# EasyEDA Pro project main.eprj

# Schematic Schematic

## Sheets
1 ESP32-S3-Mini-1U-N4R2: Board Name: Board1; Create Date: 2026-08-17; Page Name: P1; Project Name: ESP32-S3; Schematic Name: Schematic1; Update Date: 2026-08-17; Company: EasyEDA.com; Page Size: A4; Version: V1.0
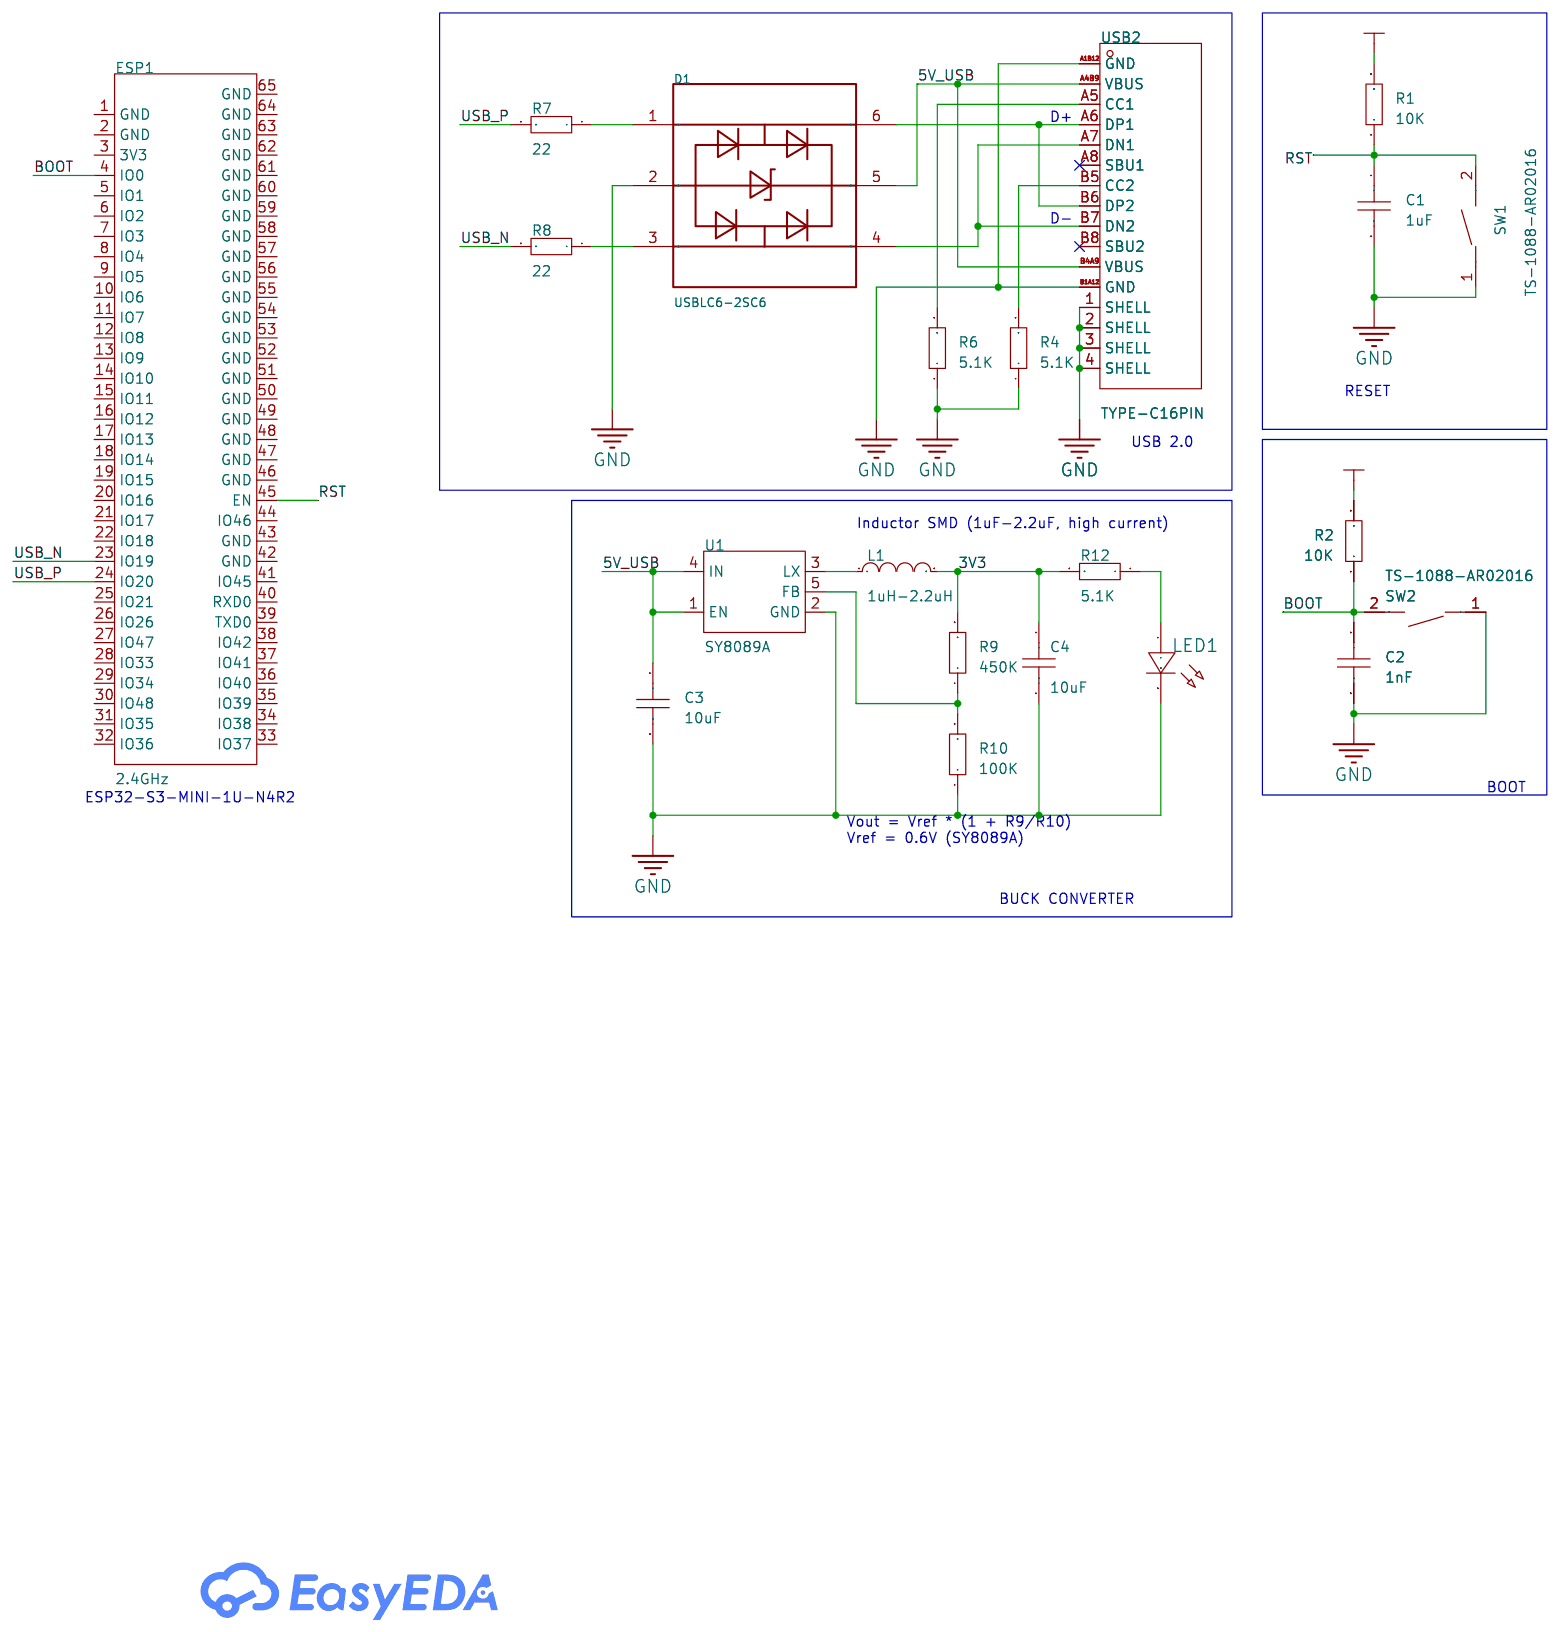
[diagram p0: ESP32-S3-Mini-1U-N4R2]
2 SIM7670G: Create Date: 2026-08-18; Page Name: SIM7670G; Schematic Name: Schematic; Update Date: 2026-08-18
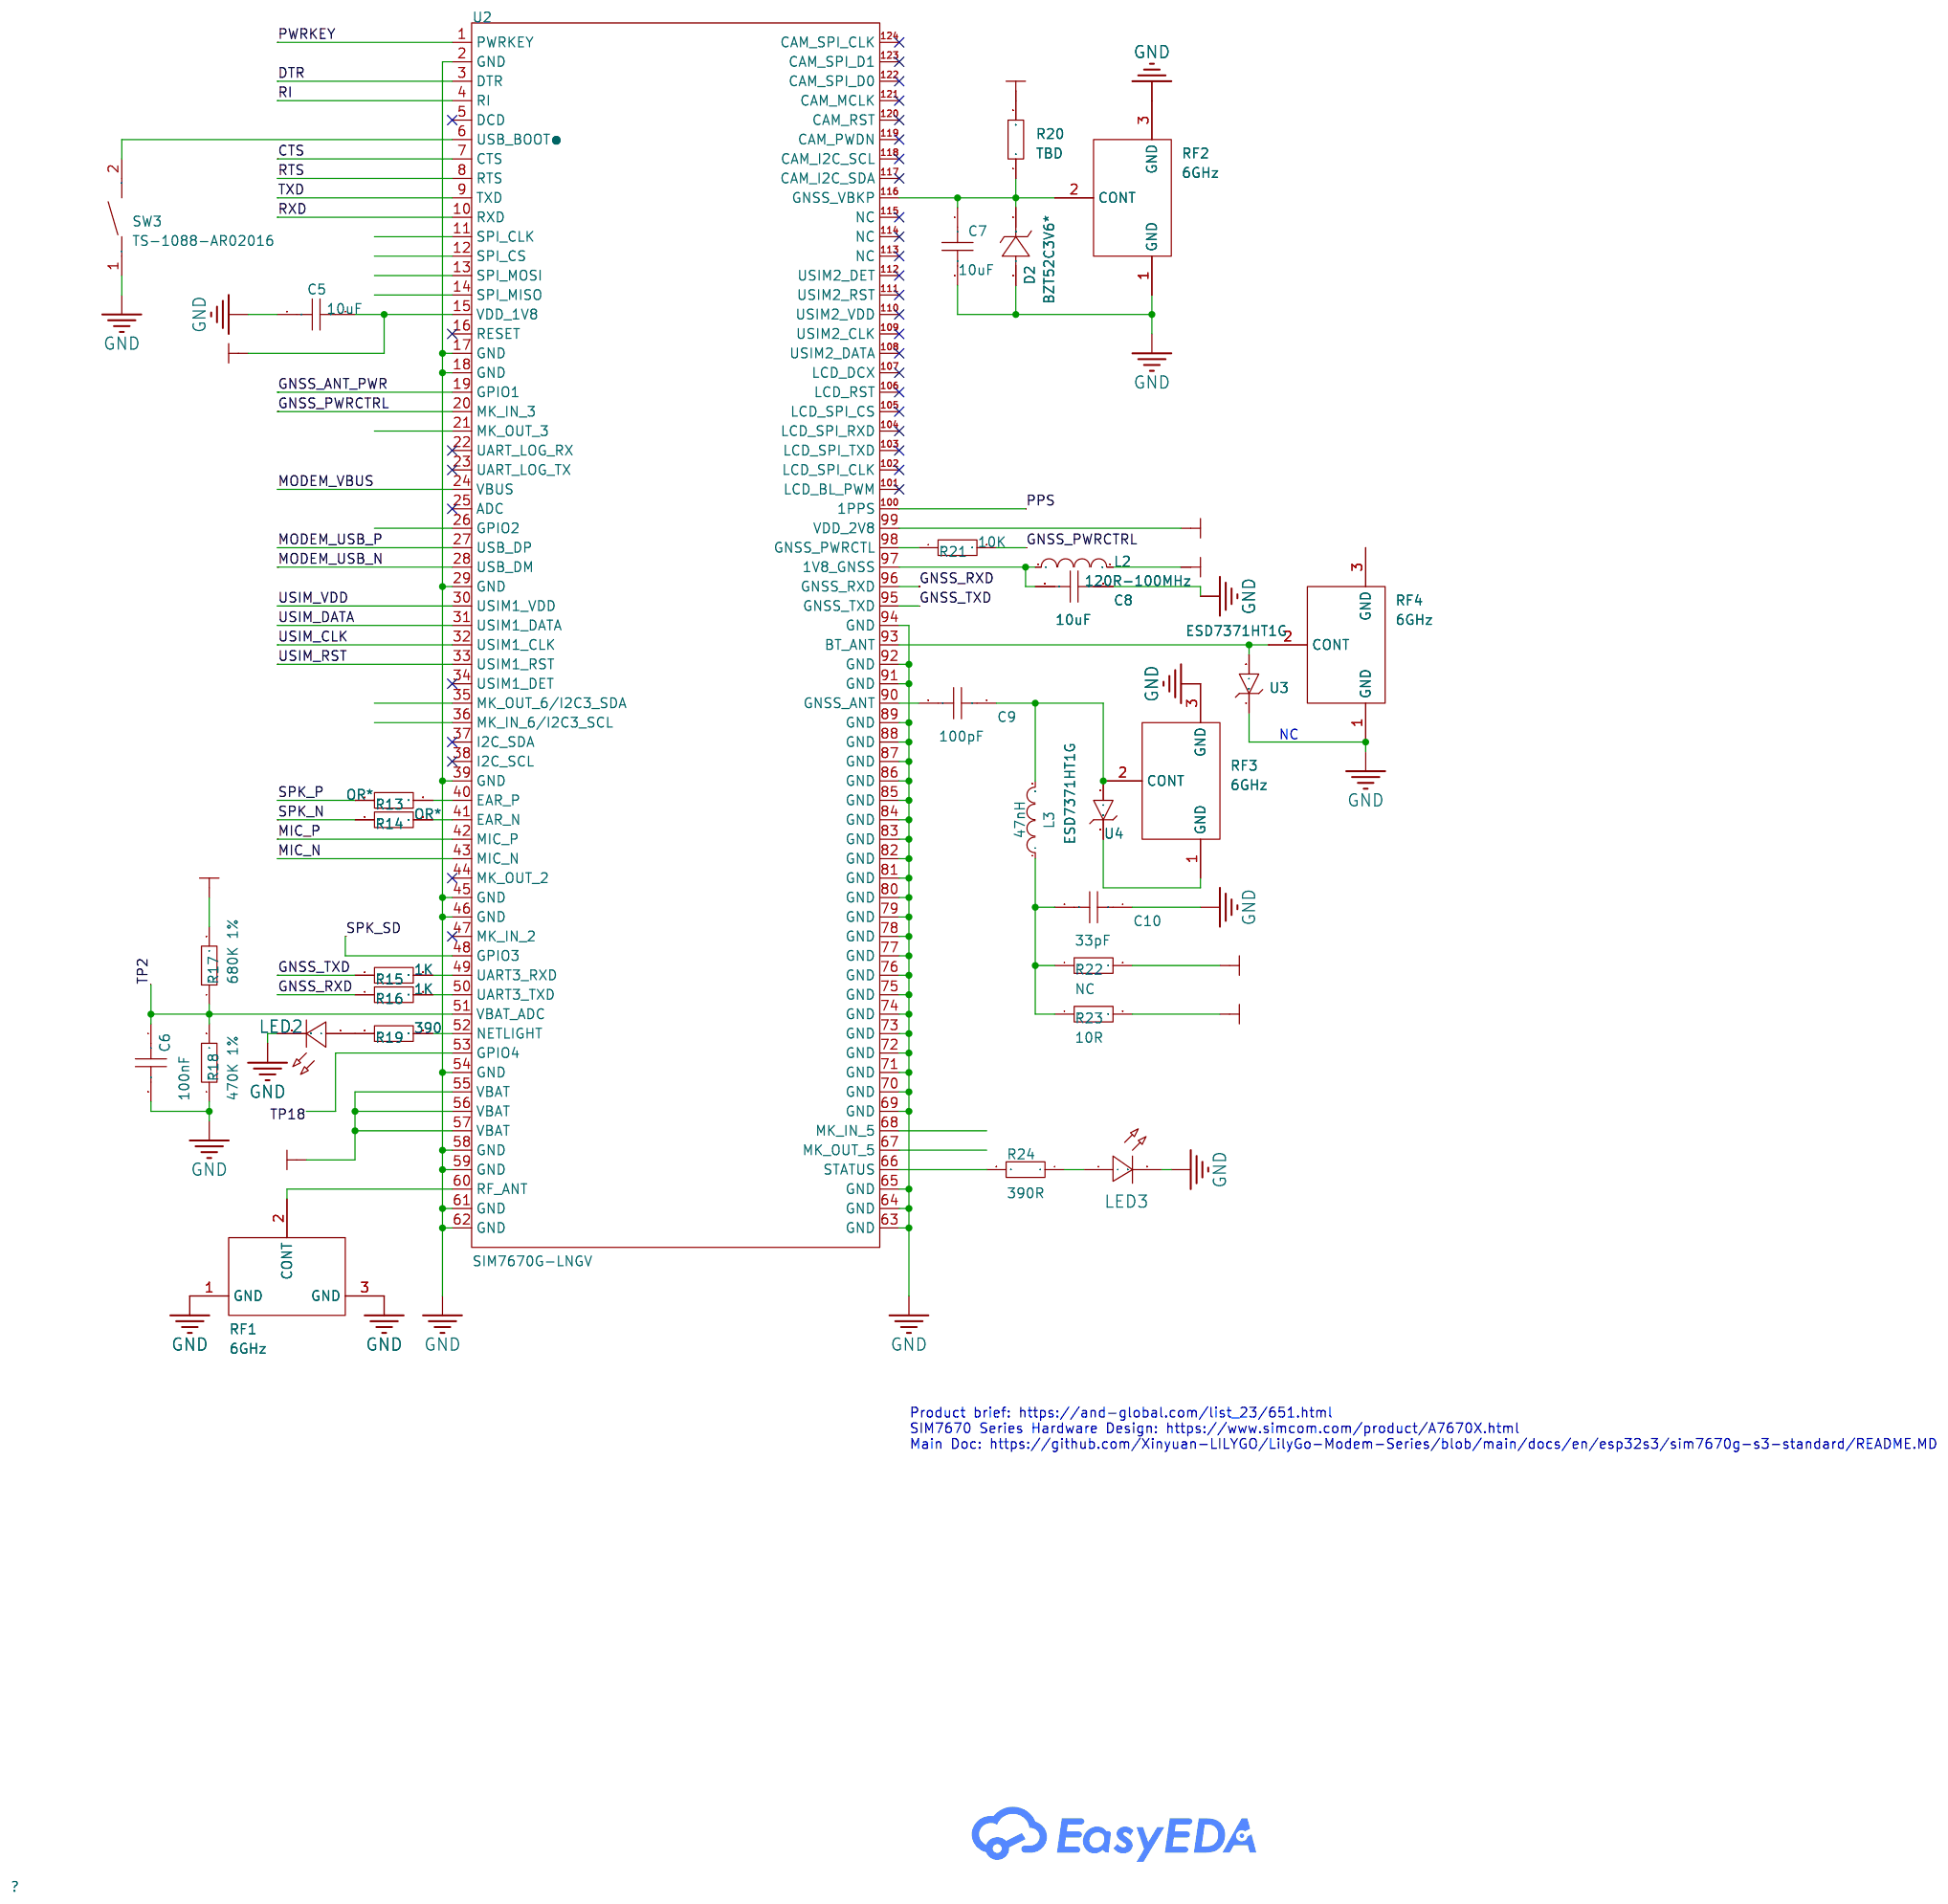
[diagram p1: SIM7670G]
3 SIM7670C: Create Date: 2026-08-18; Project Name: Project Name; Schematic Name: Schematic Name; Update Date: 2021.11.05
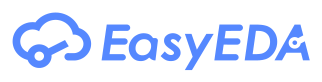
[diagram p2: SIM7670C]

## Parts
sheet ESP32-S3-Mini-1U-N4R2
C1  1uF  [C0603]
C2  1nF  [C0603]
C3  10uF  [C0603]
C4  10uF  [C0603]
D1  USBLC6-2SC6  [TSOT-23-6_L2.9-W1.6-P0.95-LS2.8-BR]
ESP1  2.4GHz  [BULETM-SMD_ESPRESSIF_ESP32-S3-MINI-1U-N8]
L1  1uH-2.2uH  [L0603]
LED1  -  [LED0402-RD_YELLOW]
R1  10K  [R0603]
R2  10K  [R0603]
R4  5.1K  [R0603]
R6  5.1K  [R0603]
R7  22  [R0603]
R8  22  [R0603]
R9  450K  [R0603]
R10  100K  [R0603]
R12  5.1K  [R0603]
SW1  TS-1088-AR02016  [SW-SMD_L3.9-W3.0-P4.45]
SW2  TS-1088-AR02016  [SW-SMD_L3.9-W3.0-P4.45]
U1  SY8089A  [SOT-23-5_L3.0-W1.7-P0.95-LS2.8-BL]
USB2  TYPE-C16PIN  [USB-C-SMD_TYPE-C16PIN]
sheet SIM7670G
C5  10uF  [C0603]
C6  100nF  [C0603]
C7  10uF  [C0603]
C8  10uF  [C0603]
C9  100pF  [C0603]
C10  33pF  [C0603]
D2  BZT52C3V6*  [SOD-123_L2.8-W1.8-LS3.7-RD]
L2  120R-100MHz  [L0603]
L3  47nH  [L0603]
LED2  -  [LED0402-RD_YELLOW]
LED3  -  [LED0402-RD_YELLOW]
R13  OR*  [R0603]
R14  OR*  [R0603]
R15  1K  [R0603]
R16  1K  [R0603]
R17  680K 1%  [R0603]
R18  470K 1%  [R0603]
R19  390  [R0603]
R20  TBD  [R0603]
R21  10K  [R0603]
R22  NC  [R0603]
R23  10R  [R0603]
R24  390R  [R0603]
RF1  6GHz  [ANT-SMD_UFL-R-SMT01]
RF2  6GHz  [ANT-SMD_UFL-R-SMT01]
RF3  6GHz  [ANT-SMD_UFL-R-SMT01]
RF4  6GHz  [ANT-SMD_UFL-R-SMT01]
SW3  TS-1088-AR02016  [SW-SMD_L3.9-W3.0-P4.45]
U2  SIM7670G-LNGV  [LCC-124_L24.0-W24.0-P1.0-TL]
U3  ESD7371HT1G  [SOD-323_L1.7-W1.3-LS2.5-RD]
U4  ESD7371HT1G  [SOD-323_L1.7-W1.3-LS2.5-RD]

## Library data of the parts
C1-C10 = CAP_0603: Supplier Footprint: 0603
D1 = USBLC6-2SC6_C48971164: LCSC Part Name: ESD 5V截止 峰值浪涌电流：6A@8/20us; Supplier Part: C48971164; Manufacturer: Slkor(萨科微); Supplier Footprint: SOT-23-6L; JLCPCB Part Class: Extended Part; Datasheet: https://item.szlcsc.com/datasheet/USBLC6-2SC6/51296793.html; Supplier: LCSC; Reverse Stand-Off Voltage (Vrwm): 5V; Clamping Voltage: 13V; Peak Pulse Current (Ipp): 6A@8/20us; Peak Pulse Power Dissipation (Ppp): 78W@8/20us; Voltage - Breakdown: 9V; Reverse Leakage Current (Ir): 100nA; Number of Channels: 2; Operating Temperature: -40℃~+125℃; level of protection: IEC 61000-4-2; Type: ESD; Junction Capacitance: 0.5pF；1pF
ESP1 = ESP32-S3-MINI-1U-N4R2: LCSC Part Name: 不带固件 小尺寸模组，集成2.4GHz Wi-Fi(802.11b/g/n)+Bluetooth 5(LE); Supplier Part: C22356044; Manufacturer: ESPRESSIF(乐鑫); Supplier Footprint: SMD,15.4x15.4mm; JLCPCB Part Class: Extended Part; Datasheet: https://item.szlcsc.com/datasheet/ESP32-S3-MINI-1U-N4R2/23788626.html; Supplier: LCSC; Utilized IC / Part: ESP32-S3FH4R2; Interface Type: I2C；UART；SPI；USB；I2S; Output Power: 20.5dBm; Voltage - Supply: 3V~3.6V; Receive  Current: 95mA; Send  Current: 355mA; Sensitivity: -98.2dBm; Operating Temperature: -40℃~+85℃
L1-L3 = L_0603
LED1-LED3 = LED_0402-R: Supplier Footprint: 0402
R1 R2 R4 R6-R10 R12-R24 = Res_0603: Supplier Footprint: 0603
SW1-SW3 = TS-1088-AR02016: LCSC Part Name: 3.9*3*2mm 立贴 轻触开关; Supplier Part: C720477; Manufacturer: XUNPU(讯普); Supplier Footprint: SMD,4x3mm; JLCPCB Part Class: Basic Part; Datasheet: https://item.szlcsc.com/datasheet/TS-1088-AR02016/763484.html; Supplier: LCSC; Circuit: SPST; Actuator Style: Round Button; Operating Force: 1.6N; Mounting Type: Surface Mount,Vertical; Length: 3.9mm; Width: 3mm; Switch Height: 2mm; with Bracket: Without Bracket; Contact Current: 50mA; Voltage Rating: 12V; Actuator/Cap Color: Black; Termination Style: SMD(SMT) Tab; Life: 100,000 cycles; Operating Temperature: -30℃~+80℃
U1 = SY8089A: LCSC Part Name: 降压型 2A 2.5V~5.5V; Supplier Part: C41348273; Manufacturer: TECH PUBLIC(台舟); Supplier Footprint: SOT-23-5; JLCPCB Part Class: Extended Part; Datasheet: https://item.szlcsc.com/datasheet/SY8089A/43078192.html; Supplier: LCSC; Function: Step-down type; Voltage - Supply: 2.5V~5.5V; Output Current: 2A; Frequency - Switching: 1MHz; Operating Temperature: -40℃~+125℃@(TJ); Synchronous Rectifier: No; Number of Outputs: 1; Topology: Buck; Quiescent Current: 50uA; Switch tube (built-in/external): Built-in; Output Type: Adjustable; Features: Cycle-by-cycle current limiting；Overcurrent Protection
USB2 = TYPE-C16PIN: LCSC Part Name: 16P卧贴母座; Supplier Part: C393939; Manufacturer: SHOU HAN(首韩); Supplier Footprint: SMD; JLCPCB Part Class: Extended Part; Datasheet: https://item.szlcsc.com/datasheet/TYPE-C16PIN/372551.html; Supplier: LCSC; Connector Type: Type-C; Gender: Female; Mounting Type: Surface Mount, Right Angle; Number of Contacts: 16P; Number of Ports: 1; Current Rating-Power: 3A; Voltage Rating: 30V; Connect-Disconnect Life: 10,000 Cycles; Detection color: Black; Operating Temperature: -40℃~+85℃
D2 = BZT52C3V6_C49652771: LCSC Part Name: 3.6V 5uA@1.0V; Supplier Part: C49652771; Manufacturer: PAKER(派克微); Supplier Footprint: SOD-123; JLCPCB Part Class: Extended Part; Datasheet: https://item.szlcsc.com/datasheet/BZT52C3V6/52209955.html; Supplier: LCSC; Diode Configuration: 1 Independent; Zener Voltage(Nom): 3.6V; Reverse Leakage Current (Ir): 5uA@1V; Zener Voltage(Range): 3.4V~3.8V; Pd - Power Dissipation: 350mW; Impedance(Zzt): 90Ω; Impedance(Zzk): 600Ω
RF1-RF4 = U.FL-R-SMT(01): LCSC Part Name: IPEX 内针; Supplier Part: C434812; Manufacturer: HRS(广濑); Supplier Footprint: SMD; JLCPCB Part Class: Extended Part; Datasheet: https://item.szlcsc.com/datasheet/U.FL-R-SMT(01)/432323.html; Supplier: LCSC; Connector Type: Board Side; Interface: Male Pin; Number of Ports: 1; Interface Diameter: 2mm; Interface Length/Height: 1.25mm; RF Series: IPEX; Impedance: 50Ω; Operating Temperature Range: -40℃~+90℃
U2 = SIM7670G-LNGV: LCSC Part Name: LTE Cat 1bis模块; Supplier Part: C45935408; Manufacturer: SIMCOM(芯讯通无线科技); Supplier Footprint: SMD,24x24mm; JLCPCB Part Class: Extended Part; Datasheet: https://item.szlcsc.com/datasheet/SIM7670G-LNGV/48042558.html; Supplier: LCSC; Communication System: TDD-LTE；FDD-LTE; Interface: I2C；UART；USB；GPIO; Voltage - Supply: 3.4V~4.2V; Current Consumption: 800uA; Features: DFOTA function; Operating Temperature: -30℃~+75℃
U3 U4 = ESD7371HT1G: LCSC Part Name: ESD 5.3V截止; Supplier Part: C890628; Manufacturer: onsemi(安森美); Supplier Footprint: SOD-323; JLCPCB Part Class: Extended Part; Datasheet: https://item.szlcsc.com/datasheet/ESD7371HT1G/956098.html; Supplier: LCSC; Reverse Stand-Off Voltage (Vrwm): 5.3V; Clamping Voltage: 20V; Voltage - Breakdown: 7V; Reverse Leakage Current (Ir): 50nA; Number of Channels: 1; level of protection: IEC 61000-4-2; Type: ESD; Junction Capacitance: 0.7pF

## Nets
3.3V: R1.2 R2.2
3V3: C4.1 L1.2 R9.2 R12.2
5V_USB: C3.1 D1.5(VBUS) U1.1(EN) U1.4(IN) USB2.A4B9(VBUS) USB2.B4A9(VBUS)
+1.8V: C5.1 U2.15(VDD_1V8)
+1V8: L2.2
+3V6: U2.55(VBAT) U2.56(VBAT) U2.57(VBAT)
GND: C1.2 C2.2 C3.2 C4.2 C5.2 C6.2 C7.2 C8.1 C10.1 D1.2(GND) D2.2(A) LED1.2(C) LED2.2(C) LED3.2(C) R4.1 R6.1 R10.1 R18.1 RF1.1(GND) RF1.3(GND) RF2.1(GND) RF2.3(GND) RF3.3(GND) RF4.1(GND) SW1.1 SW2.1 SW3.1 U1.2(GND) U2.2(GND) U2.17(GND) U2.18(GND) U2.29(GND) U2.39(GND) U2.45(GND) U2.46(GND) U2.54(GND) U2.58(GND) U2.59(GND) U2.61(GND) U2.62(GND) U2.63(GND) U2.64(GND) U2.65(GND) U2.69(GND) U2.70(GND) U2.71(GND) U2.72(GND) U2.73(GND) U2.74(GND) U2.75(GND) U2.76(GND) U2.77(GND) U2.78(GND) U2.79(GND) U2.80(GND) U2.81(GND) U2.82(GND) U2.83(GND) U2.84(GND) U2.85(GND) U2.86(GND) U2.87(GND) U2.88(GND) U2.89(GND) U2.91(GND) U2.92(GND) U2.94(GND) U3.1(C) USB2.1(SHELL) USB2.2(SHELL) USB2.3(SHELL) USB2.4(SHELL) USB2.A1B12(GND) USB2.B1A12(GND)
VBAT: R17.2
VDD_AUX: R22.2 U2.99(VDD_2V8)
VDD_GPS: R20.2 R23.2
BOOT: C2.1 ESP1.4(IO0) R2.1 SW2.2
CTS: U2.7(CTS)
DTR: U2.3(DTR)
GNSS_ANT_PWR: U2.19(GPIO1)
GNSS_PWRCTRL: R21.2 U2.20(MK_IN_3)
GNSS_RXD: R16.1 U2.96(GNSS_RXD)
GNSS_TXD: R15.1 U2.95(GNSS_TXD)
MIC_N: U2.43(MIC_N)
MIC_P: U2.42(MIC_P)
MODEM_USB_N: U2.28(USB_DM)
MODEM_USB_P: U2.27(USB_DP)
MODEM_VBUS: U2.24(VBUS)
PPS: U2.100(1PPS)
PWRKEY: U2.1(PWRKEY)
RI: U2.4(RI)
RST: C1.1 ESP1.45(EN) R1.1 SW1.2
RTS: U2.8(RTS)
RXD: U2.10(RXD)
SPK_N: R14.1
SPK_P: R13.1
SPK_SD: U2.48(GPIO3)
TP2: C6.1 R17.1 R18.2 U2.51(VBAT_ADC)
TP18: U2.53(GPIO4)
TXD: U2.9(TXD)
USB_N: ESP1.23(IO19) R8.2
USB_P: ESP1.24(IO20) R7.2
USIM_CLK: U2.32(USIM1_CLK)
USIM_DATA: U2.31(USIM1_DATA)
USIM_RST: U2.33(USIM1_RST)
USIM_VDD: U2.30(USIM1_VDD)
Net-(C7-1): C7.1 D2.1(C) R20.1 RF2.2(CONT) U2.116(GNSS_VBKP)
Net-(C8-2): C8.2 L2.1 U2.97(1V8_GNSS)
Net-(C9-1): C9.1 L3.2 RF3.2(CONT) U4.2(A)
Net-(C9-2): C9.2 U2.90(GNSS_ANT)
Net-(C10-2): C10.2 L3.1 R22.1 R23.1
Net-(D1-1): D1.1(I/O1) R7.1
Net-(D1-3): D1.3(I/O2) R8.1
Net-(D1-4): D1.4(I/O2) USB2.A7(DN1) USB2.B7(DN2)
Net-(D1-6): D1.6(I/O1) USB2.A6(DP1) USB2.B6(DP2)
Net-(L1-1): L1.1 U1.3(LX)
Net-(LED1-1): LED1.1(A) R12.1
Net-(LED2-1): LED2.1(A) R19.1
Net-(LED3-1): LED3.1(A) R24.1
Net-(R4-2): R4.2 USB2.B5(CC2)
Net-(R6-2): R6.2 USB2.A5(CC1)
Net-(R9-1): R9.1 R10.2 U1.5(FB)
Net-(R13-2): R13.2 U2.40(EAR_P)
Net-(R14-2): R14.2 U2.41(EAR_N)
Net-(R15-2): R15.2 U2.49(UART3_RXD)
Net-(R16-2): R16.2 U2.50(UART3_TXD)
Net-(R19-2): R19.2 U2.52(NETLIGHT)
Net-(R21-1): R21.1 U2.98(GNSS_PWRCTL)
Net-(R24-2): R24.2 U2.66(STATUS)
Net-(RF1-2): RF1.2(CONT) U2.60(RF_ANT)
Net-(RF3-1): RF3.1(GND) U4.1(C)
Net-(RF4-2): RF4.2(CONT) U2.93(BT_ANT) U3.2(A)
Net-(SW3-2): SW3.2 U2.6(USB_BOOT●)

Not connected (* = marked no-connect by the designer): ESP1 1(GND) 2(GND) 3(3V3) 5(IO1) 6(IO2) 7(IO3) 8(IO4) 9(IO5) 10(IO6) 11(IO7) 12(IO8) 13(IO9) 14(IO10) 15(IO11) 16(IO12) 17(IO13) 18(IO14) 19(IO15) 20(IO16) 21(IO17) 22(IO18) 25(IO21) 26(IO26) 27(IO47) 28(IO33) 29(IO34) 30(IO48) 31(IO35) 32(IO36) 33(IO37) 34(IO38) 35(IO39) 36(IO40) 37(IO41) 38(IO42) 39(TXD0) 40(RXD0) 41(IO45) 42(GND) 43(GND) 44(IO46) 46(GND) 47(GND) 48(GND) 49(GND) 50(GND) 51(GND) 52(GND) 53(GND) 54(GND) 55(GND) 56(GND) 57(GND) 58(GND) 59(GND) 60(GND) 61(GND) 62(GND) 63(GND) 64(GND) 65(GND); RF4 3(GND); U2 5(DCD)* 11(SPI_CLK) 12(SPI_CS) 13(SPI_MOSI) 14(SPI_MISO) 16(RESET)* 21(MK_OUT_3) 22(UART_LOG_RX)* 23(UART_LOG_TX)* 25(ADC)* 26(GPIO2) 34(USIM1_DET)* 35(MK_OUT_6/I2C3_SDA) 36(MK_IN_6/I2C3_SCL) 37(I2C_SDA)* 38(I2C_SCL)* 44(MK_OUT_2)* 47(MK_IN_2)* 67(MK_OUT_5) 68(MK_IN_5) 101(LCD_BL_PWM)* 102(LCD_SPI_CLK)* 103(LCD_SPI_TXD)* 104(LCD_SPI_RXD)* 105(LCD_SPI_CS)* 106(LCD_RST)* 107(LCD_DCX)* 108(USIM2_DATA)* 109(USIM2_CLK)* 110(USIM2_VDD)* 111(USIM2_RST)* 112(USIM2_DET)* 113(NC)* 114(NC)* 115(NC)* 117(CAM_I2C_SDA)* 118(CAM_I2C_SCL)* 119(CAM_PWDN)* 120(CAM_RST)* 121(CAM_MCLK)* 122(CAM_SPI_D0)* 123(CAM_SPI_D1)* 124(CAM_SPI_CLK)*; USB2 A8(SBU1)* B8(SBU2)*

## Notes on the sheets
sheet 1
- D+
- D-
- RESET
- USB 2.0
- Inductor SMD (1uF-2.2uF, high current)
- ESP32-S3-MINI-1U-N4R2
- BOOT
- Vout = Vref * (1 + R9/R10)
  Vref = 0.6V (SY8089A)
- BUCK CONVERTER
sheet 2
- NC
- Product brief: https://and-global.com/list_23/651.html
  SIM7670 Series Hardware Design: https://www.simcom.com/product/A7670X.html
  Main Doc: https://github.com/Xinyuan-LILYGO/LilyGo-Modem-Series/blob/main/docs/en/esp32s3/sim7670g-s3-standard/README.MD
